# EAGLE schematic big_8x16 (EAGLE 6.2)
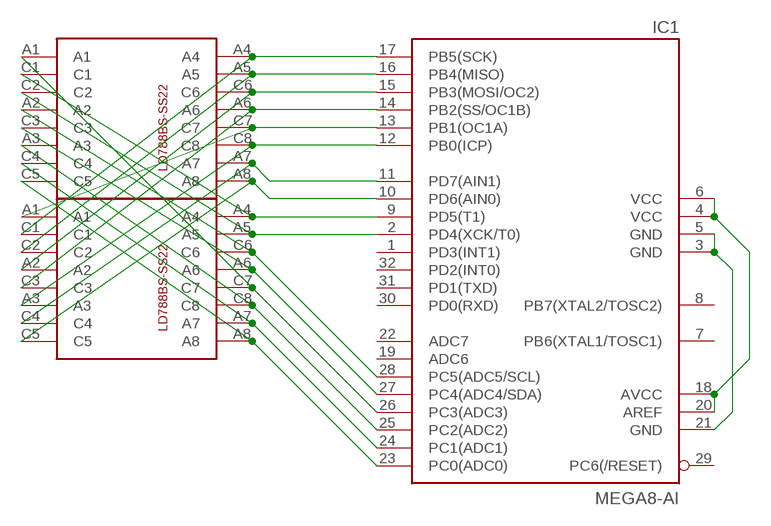
[diagram p0: schematic, sheet 1]

## Parts
IC1  MEGA8-AI  [TQFP32-08]
U$1  LD-1088BS  [LD-1088BS]
U$2  LD-1088BS  [LD-1088BS]

## Nets
N$1: IC1.24(PC1(ADC1)) U$1.A7 U$2.C4
N$2: IC1.25(PC2(ADC2)) U$1.C8 U$2.A3
N$3: IC1.26(PC3(ADC3)) U$1.C7 U$2.A1
N$4: IC1.27(PC4(ADC4/SDA)) U$1.A6 U$2.C3
N$5: IC1.28(PC5(ADC5/SCL)) U$1.C6 U$2.A2
N$6: IC1.2(PD4(XCK/T0)) U$1.A5 U$2.C2
N$7: IC1.9(PD5(T1)) U$1.A4 U$2.C1
N$8: IC1.15(PB3(MOSI/OC2)) U$1.A2 U$2.C6
N$9: IC1.14(PB2(SS/OC1B)) U$1.C3 U$2.A6
N$10: IC1.13(PB1(OC1A)) U$1.A1 U$2.C7
N$11: IC1.12(PB0(ICP)) U$1.A3 U$2.C8
N$12: IC1.11(PD7(AIN1)) U$1.C4 U$2.A7
N$13: IC1.10(PD6(AIN0)) U$1.C5 U$2.A8
N$14: IC1.16(PB4(MISO)) U$1.C2 U$2.A5
N$15: IC1.17(PB5(SCK)) U$1.C1 U$2.A4
N$17: IC1.23(PC0(ADC0)) U$1.A8 U$2.C5
N$18: IC1.3(GND) IC1.5(GND) IC1.21(GND)
N$19: IC1.4(VCC) IC1.6(VCC) IC1.18(AVCC) IC1.20(AREF)
Unconnected: IC1.1(PD3(INT1)) IC1.7(PB6(XTAL1/TOSC1)) IC1.8(PB7(XTAL2/TOSC2)) IC1.19(ADC6) IC1.22(ADC7) IC1.29(PC6(/RESET)) IC1.30(PD0(RXD)) IC1.31(PD1(TXD)) IC1.32(PD2(INT0))

## Library data of the parts
IC1 = atmel:MEGA8: MICROCONTROLLER 8 Kbytes FLASH, 1 kbytes SRAM, 512 bytes EEPROM, USART, 6-channel 10 bit ADC, 2-channel 8 bit ADC Pin compatible with Atmega48, ATMega88, ATMega168 Source: avr.lbr; MPN: ATMEGA8-16AU; OC_FARNELL: 9171371; OC_NEWARK: 73M8863
U$1 U$2 = mrule:LD-1088BS